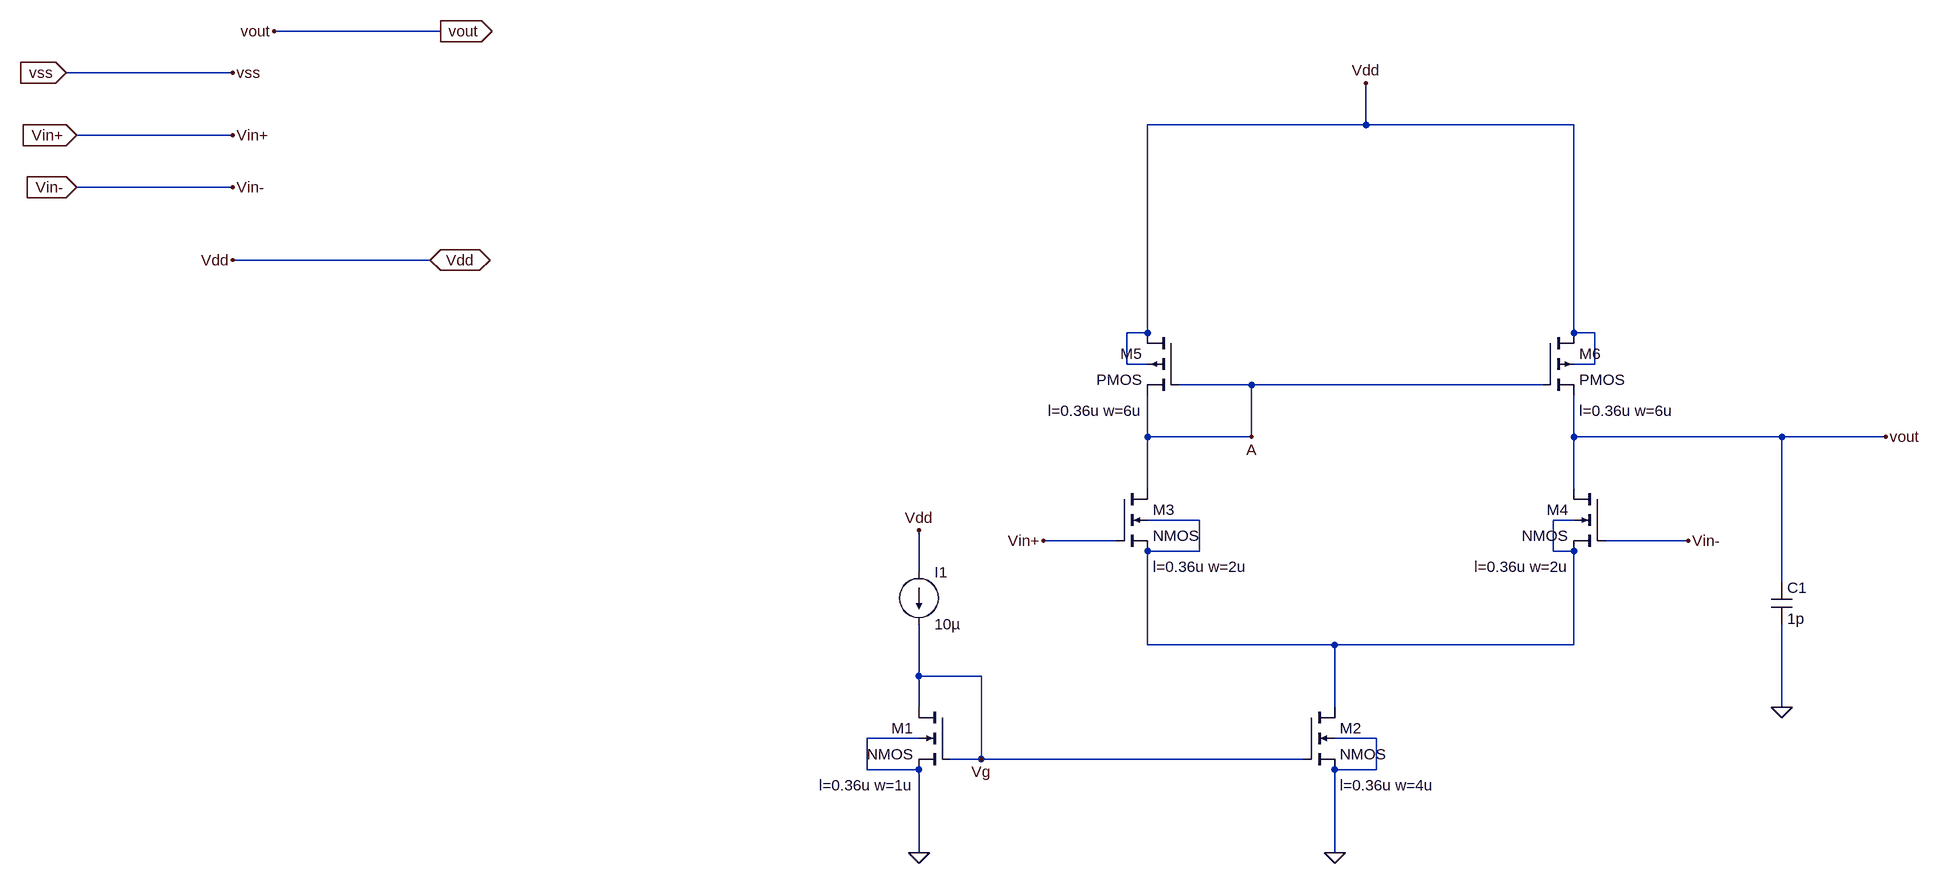
[diagram p0: schematic erroramp_ldo.asc]
erroramp_ldo.asc, the LTspice schematic file:
Version 4
SHEET 1 2980 1012
WIRE 128 -1008 -128 -1008
WIRE -192 -944 -448 -944
WIRE 1552 -864 1552 -928
WIRE 1552 -864 1216 -864
WIRE 1872 -864 1552 -864
WIRE -192 -848 -432 -848
WIRE -192 -768 -432 -768
WIRE 112 -656 -192 -656
WIRE 1216 -544 1216 -864
WIRE 1216 -544 1184 -544
WIRE 1872 -544 1872 -864
WIRE 1904 -544 1872 -544
WIRE 1184 -496 1184 -544
WIRE 1216 -496 1184 -496
WIRE 1904 -496 1904 -544
WIRE 1904 -496 1872 -496
WIRE 1376 -464 1264 -464
WIRE 1824 -464 1376 -464
WIRE 1216 -384 1216 -448
WIRE 1376 -384 1376 -464
WIRE 1376 -384 1216 -384
WIRE 1872 -384 1872 -448
WIRE 2192 -384 1872 -384
WIRE 2352 -384 2192 -384
WIRE 1216 -304 1216 -384
WIRE 1872 -304 1872 -384
WIRE 1296 -256 1216 -256
WIRE 1872 -256 1840 -256
WIRE 1168 -224 1056 -224
WIRE 2048 -224 1920 -224
WIRE 1296 -208 1296 -256
WIRE 1296 -208 1216 -208
WIRE 1840 -208 1840 -256
WIRE 1872 -208 1840 -208
WIRE 864 -176 864 -240
WIRE 2192 -160 2192 -384
WIRE 1216 -64 1216 -208
WIRE 1504 -64 1216 -64
WIRE 1872 -64 1872 -208
WIRE 1872 -64 1504 -64
WIRE 864 -16 864 -96
WIRE 960 -16 864 -16
WIRE 864 32 864 -16
WIRE 1504 32 1504 -64
WIRE 2192 32 2192 -96
WIRE 864 80 784 80
WIRE 1568 80 1504 80
WIRE 960 112 960 -16
WIRE 960 112 912 112
WIRE 1456 112 960 112
WIRE 784 128 784 80
WIRE 864 128 784 128
WIRE 1568 128 1568 80
WIRE 1568 128 1504 128
WIRE 864 256 864 128
WIRE 1504 256 1504 128
FLAG 864 -240 Vdd
FLAG 960 112 Vg
FLAG 1056 -224 Vin+
FLAG 2048 -224 Vin-
FLAG 1552 -928 Vdd
FLAG 1376 -384 A
FLAG 1504 256 0
FLAG 864 256 0
FLAG 2352 -384 vout
FLAG 128 -1008 vout
IOPIN 128 -1008 Out
FLAG -432 -848 Vin+
IOPIN -432 -848 In
FLAG -432 -768 Vin-
IOPIN -432 -768 In
FLAG 112 -656 Vdd
IOPIN 112 -656 BiDir
FLAG -192 -656 Vdd
FLAG -192 -848 Vin+
FLAG -192 -768 Vin-
FLAG -448 -944 vss
IOPIN -448 -944 In
FLAG -128 -1008 vout
FLAG -192 -944 vss
FLAG 2192 32 0
SYMBOL nmos4 912 32 M0
WINDOW 123 56 120 Left 2
SYMATTR Value2 l=0.36u w=1u
SYMATTR InstName M1
SYMBOL current 864 -176 R0
WINDOW 123 0 0 Left 0
WINDOW 39 0 0 Left 0
SYMATTR InstName I1
SYMATTR Value 10µ
SYMBOL nmos4 1456 32 R0
WINDOW 123 56 120 Left 2
SYMATTR Value2 l=0.36u w=4u
SYMATTR InstName M2
SYMBOL nmos4 1168 -304 R0
WINDOW 123 56 120 Left 2
SYMATTR Value2 l=0.36u w=2u
SYMATTR InstName M3
SYMBOL nmos4 1920 -304 M0
WINDOW 123 56 120 Left 2
SYMATTR Value2 l=0.36u w=2u
SYMATTR InstName M4
SYMBOL pmos4 1264 -544 M0
WINDOW 123 56 120 Left 2
SYMATTR Value2 l=0.36u w=6u
SYMATTR InstName M5
SYMBOL pmos4 1824 -544 R0
WINDOW 123 56 120 Left 2
SYMATTR Value2 l=0.36u w=6u
SYMATTR InstName M6
SYMBOL cap 2176 -160 R0
SYMATTR InstName C1
SYMATTR Value 1p

The netlist it stands for:
* erroramp_ldo.asc
M1 Vg Vg 0 0 NMOS l=0.36u w=1u
I1 Vdd Vg 10µ
M2 N001 Vg 0 0 NMOS l=0.36u w=4u
M3 A Vin+ N001 N001 NMOS l=0.36u w=2u
M4 vout Vin- N001 N001 NMOS l=0.36u w=2u
M5 Vdd A A Vdd PMOS l=0.36u w=6u
M6 Vdd A vout Vdd PMOS l=0.36u w=6u
C1 vout 0 1p
.model NMOS NMOS
.model PMOS PMOS
.lib standard.mos
.backanno
.end